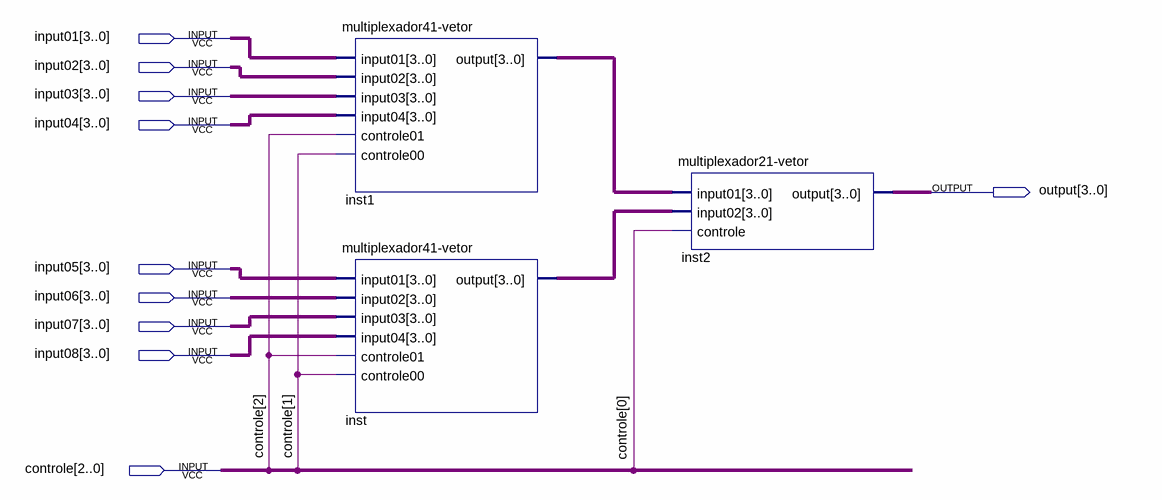
[diagram p0: schematic sheet]
// Quartus schematic multiplexador81-vetor.bdf as structural Verilog: 3 symbols, 10 pins
module \multiplexador81-vetor  (
  input  [3:0] input01,
  input  [3:0] input02,
  input  [3:0] input03,
  input  [3:0] input04,
  input  [3:0] input05,
  input  [3:0] input06,
  input  [3:0] input07,
  input  [3:0] input08,
  input  [2:0] controle,
  output [3:0] \output 
);

  wire [3:0] inst1_output, inst_output;

  \multiplexador41-vetor  inst1 (
    .input01(input01), .input02(input02), .input03(input03), .input04(input04), .controle01(controle[2]),
    .controle00(controle[1]), .\output (inst1_output));
  \multiplexador41-vetor  inst (
    .input01(input05), .input02(input06), .input03(input07), .input04(input08), .controle01(controle[2]),
    .controle00(controle[1]), .\output (inst_output));
  \multiplexador21-vetor  inst2 (
    .input01(inst1_output), .input02(inst_output), .controle(controle[0]), .\output (\output ));
endmodule
